# EAGLE design Shield_Slave_2_layers (EAGLE 9.1.0)
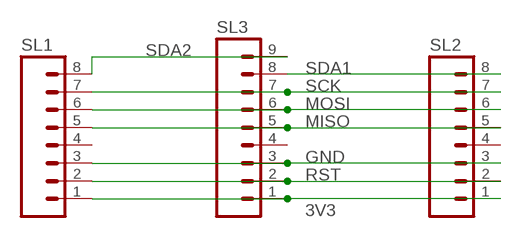
[diagram p0: schematic, sheet 1]

## Parts
SL1  M08  [08P]
SL2  M08  [08P]
SL3  M09  [09P]

## Nets
3V3: SL1.1 SL2.1 SL3.1
GND: SL1.3 SL2.3 SL3.3
MISO: SL1.5 SL2.5 SL3.5
MOSI: SL1.6 SL2.6 SL3.6
RST: SL1.2 SL2.2 SL3.2
SCK: SL1.7 SL2.7 SL3.7
SDA1: SL2.8 SL3.8
SDA2: SL1.8 SL3.9
Unconnected: SL1.4 SL2.4 SL3.4

## Library data of the parts
SL1 SL2 = con-amp-quick:M08: AMP QUICK CONNECTOR; OC_FARNELL: unknown; OC_NEWARK: unknown
SL3 = con-amp-quick:M09: AMP QUICK CONNECTOR; OC_FARNELL: unknown; OC_NEWARK: unknown

## Board
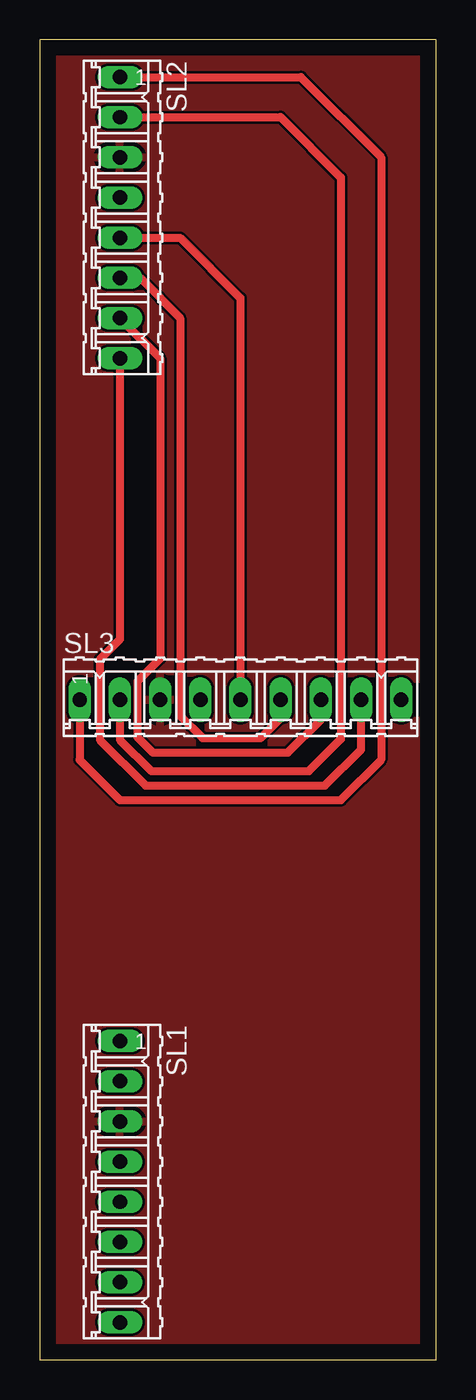
[diagram p1: board, top side]
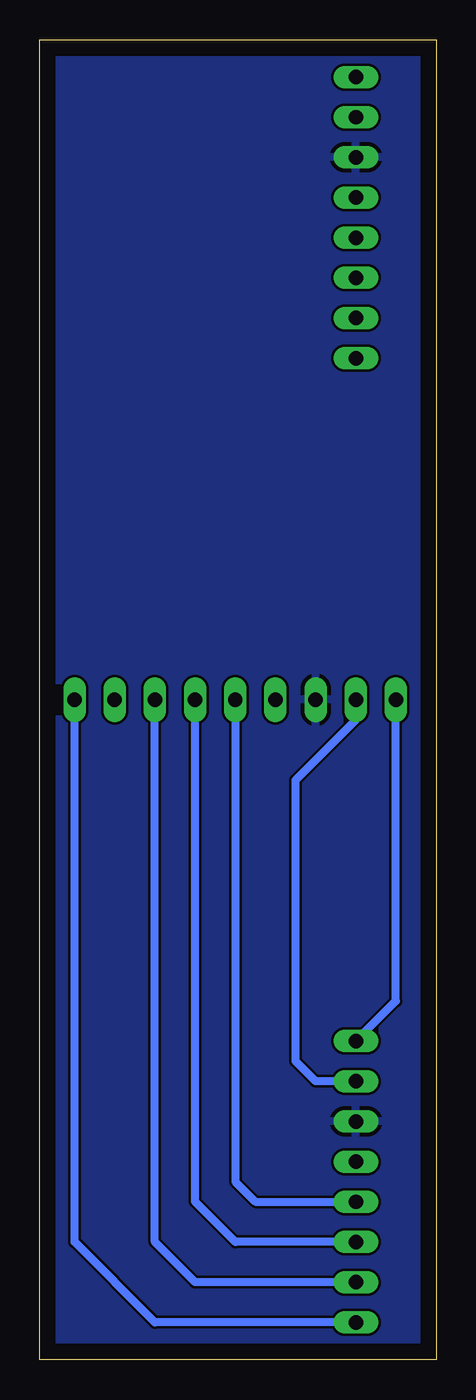
[diagram p2: board, bottom side, seen from below]

Size 25.07 x 83.49 mm. Coordinates in mm from the lower left corner, seen from the top.
Outline: 0,0 25.07,0 25.07,83.49 0,83.49 0,0
Copper layers (1*16): Top 0.035mm / dielectric 1.5mm / Bottom 0.035mm
Design rules "default": minimum track width 6mil, minimum drill 0.35mm, track to track 6mil, track to pad 6mil, pad to pad 6mil, via to via 6mil, smd to smd 6mil, copper to edge 40mil, drill to drill 6mil, minimum pad ring 10mil, minimum via ring 8mil, stop-mask expansion 4mil, vias tented up to drill 0mil, thermal gap 10mil

### Footprints (pad centres in the part's own frame; a part is rotated, then mirrored left to right if it is on the bottom)
08P = drill 0.914 long: 1 -8.89,0; 2 -6.35,0; 3 -3.81,0; 4 -1.27,0; 5 1.27,0; 6 3.81,0; 7 6.35,0; 8 8.89,0
09P = drill 0.914 long: 1 -10.16,0; 2 -7.62,0; 3 -5.08,0; 4 -2.54,0; 5 0,0; 6 2.54,0; 7 5.08,0; 8 7.62,0; 9 10.16,0

### Placement (x,y rotation side)
SL1  5.08,11.27 270 top
SL2  5.08,72.23 270 top
SL3  12.7,41.75 0 top

### Tracks (layer width: path | path; a pad name or v marks a point on that pad's centre or on a via)
3V3
  Top 0.508: SL3.1 2.54,37.94 5.08,35.4 19.05,35.4 21.59,37.94 21.59,76.04 16.51,81.12 SL2.1
  Bottom 0.508: SL1.1 2.54,22.7 SL3.1
GND
  pour Top: 0,83.5 0,0 25.4,0 25.4,83.5
  pour Bottom: 0,83.5 0,0 25.4,0 25.4,83.5
MISO
  Top 0.508: SL2.5 8.89,70.96 12.7,67.15 SL3.5
  Bottom 0.508: SL1.5 11.43,10 12.7,11.27 SL3.5
MOSI
  Top 0.508: SL3.6 15.24,40.58 13.97,39.31 10.31,39.31 8.89,40.73 8.89,65.88 6.35,68.42 SL2.6
  Bottom 0.508: SL1.6 12.7,7.46 15.24,10 SL3.6
RST
  Top 0.508: SL3.2 5.08,39.21 7.06,37.23 17.02,37.23 19.05,39.26 19.05,74.77 15.24,78.58 SL2.2
  Bottom 0.508: SL1.2 7.62,17.62 8.89,18.89 8.89,36.67 5.08,40.48 SL3.2
SCK
  Top 0.508: SL3.7 17.78,40.48 15.7,38.4 7.16,38.4 6.2,39.36 6.2,42.92 7.62,44.35 7.62,63.34 SL2.7
  Bottom 0.508: SL1.7 15.24,4.92 17.78,7.46 SL3.7
SDA1
  Top 0.508: SL3.8 20.32,38.6 18.03,36.31 6.71,36.31 3.81,39.21 3.81,44.29 5.08,45.56 SL2.8
SDA2
  Bottom 0.508: SL1.8 17.78,2.38 22.86,7.46 SL3.9